# EAGLE schematic PSU (EAGLE 7.6.0)
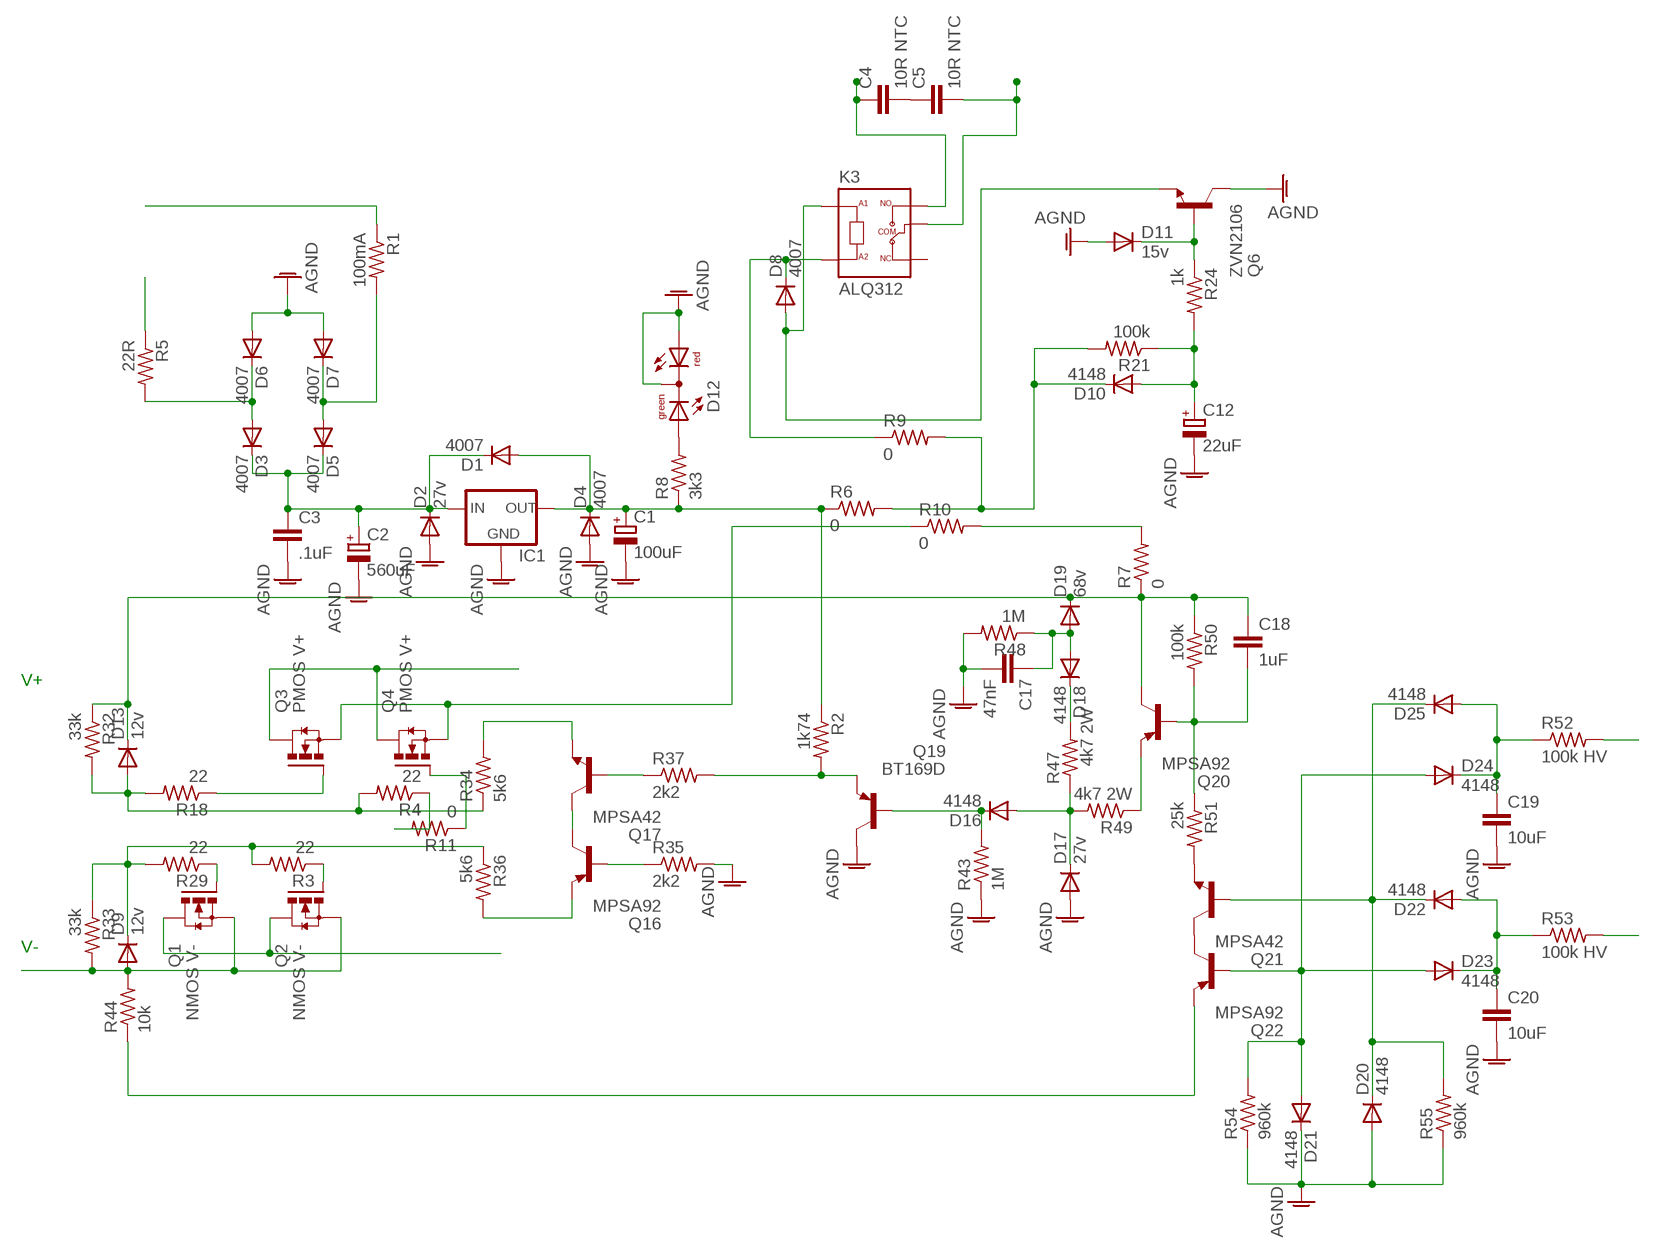
[diagram p0: schematic, sheet 1]

## Parts
C1  100uF  CPOL-EUE3.5-10  [E3,5-10]
C2  560uF  CPOL-EUE5-13  [E5-13]
C3  .1uF  C-EU075-032X103  [C075-032X103]
C4  10R NTC  C-EU075-063X106  [C075-063X106]
C5  10R NTC  C-EU075-063X106  [C075-063X106]
C12  22uF  CPOL-EUE2.5-7  [E2,5-7]
C17  47nF  C-EU050-035X075  [C050-035X075]
C18  1uF  C-EU050-035X075  [C050-035X075]
C19  10uF  C-EU050-075X075  [C050-075X075]
C20  10uF  C-EU050-075X075  [C050-075X075]
D1  4007  1N4004  [DO41-10]
D2  27v  1N4004  [DO41-10]
D3  4007  1N4004  [DO41-10]
D4  4007  1N4004  [DO41-10]
D5  4007  1N4004  [DO41-10]
D6  4007  1N4004  [DO41-10]
D7  4007  1N4004  [DO41-10]
D8  4007  1N4004  [DO41-10]
D9  12v  1N4004  [DO41-10]
D10  4148  1N4148DO35-10  [DO35-10]
D11  15v  1N4148DO35-7  [DO35-7]
D12  DUOLED5MM  [DUOLED5MM]
D13  12v  1N4004  [DO41-10]
D16  4148  1N4004  [DO41-10]
D17  27v  1N4004  [DO41-10]
D18  4148  1N4004  [DO41-10]
D19  68v  1N4004  [DO41-10]
D20  4148  1N4148DO35-7  [DO35-7]
D21  4148  1N4148DO35-7  [DO35-7]
D22  4148  1N4148DO35-7  [DO35-7]
D23  4148  1N4148DO35-7  [DO35-7]
D24  4148  1N4148DO35-7  [DO35-7]
D25  4148  1N4148DO35-7  [DO35-7]
IC1  78XXS  [78XXS]
K3  ALQ312  ALQ112  [RELAY_ALQ112]
Q1  NMOS V-  IRFP240  [TO247BV]
Q2  NMOS V-  IRFP240  [TO247BV]
Q3  PMOS V+  IRFP240  [TO247BV]
Q4  PMOS V+  IRFP240  [TO247BV]
Q6  ZVN2106  BC550B  [TO92-EBC]
Q16  MPSA92  BC560  [TO92-EBC]
Q17  MPSA42  BC550B  [TO92-EBC]
Q19  BT169D  BC560  [TO92-EBC]
Q20  MPSA92  BC560  [TO92-EBC]
Q21  MPSA42  BC550B  [TO92-EBC]
Q22  MPSA92  BC560  [TO92-EBC]
R1  100mA  R-US_0207/5V  [0207/5V]
R2  1k74  R-US_0309/10  [0309/10]
R3  22  R-US_0309/12  [0309/12]
R4  22  R-US_0309/12  [0309/12]
R5  22R  R-US_0309/12  [0309/12]
R6  0  R-US_0309/12  [0309/12]
R7  0  R-US_0309/12  [0309/12]
R8  3k3  R-US_0309/10  [0309/10]
R9  0  R-US_0309/10  [0309/10]
R10  0  R-US_0309/12  [0309/12]
R11  0  R-US_0309/12  [0309/12]
R18  22  R-US_0207/15  [0207/15]
R21  100k  R-US_0309/10  [0309/10]
R24  1k  R-US_0309/10  [0309/10]
R29  22  R-US_0207/15  [0207/15]
R32  33k  R-US_0411/15  [0411/15]
R33  33k  R-US_0411/15  [0411/15]
R34  5k6  R-US_0411/15  [0411/15]
R35  2k2  R-US_0309/10  [0309/10]
R36  5k6  R-US_0411/15  [0411/15]
R37  2k2  R-US_0309/10  [0309/10]
R43  1M  R-US_0309/10  [0309/10]
R44  10k  R-US_0411/15  [0411/15]
R47  4k7 2W  R-US_0309/10  [0309/10]
R48  1M  R-US_0411/15  [0411/15]
R49  4k7 2W  R-US_0309/10  [0309/10]
R50  100k  R-US_0309/10  [0309/10]
R51  25k  R-US_0309/10  [0309/10]
R52  100k HV  R-US_0309/12  [0309/12]
R53  100k HV  R-US_0309/12  [0309/12]
R54  960k  R-US_0309/10  [0309/10]
R55  960k  R-US_0309/10  [0309/10]

## Nets
AGND: C1.- C2.- C3.2 C12.- C17.2 C19.2 C20.2 D2.A D4.A D6.A D7.A D11.A D12.AR D12.K(C) D17.A D20.A D21.C IC1.GND Q6.C Q19.C R35.2 R43.1 R48.2 R54.1 R55.1
N$1: C2.+ C3.1 D1.C D2.C D3.C D5.C IC1.IN
N$2: D3.A D6.C R5.2
N$4: C1.+ D1.A D4.C IC1.OUT R2.1 R6.1 R8.1
N$5: D5.A D7.C R1.2
N$10: C4.1 K3.5(NO)
N$11: Q3.G R18.1
N$12: Q1.G R29.1
N$13: R4.1 R11.2
N$14: Q2.G R3.1
N$15: D8.A K3.1(A1) Q6.E
N$16: D10.C R6.2 R9.2 R21.2
N$17: R1.1
N$18: R5.1
N$19: C5.2 K3.3(COM)
N$20: D8.C K3.2(A2) R9.1
N$22: R7.2 R10.2
N$24: D12.AG R8.2
N$30: D9.C R3.2 R29.2 R33.1 R36.1
N$36: Q4.G R11.1
N$37: Q3.S Q4.S R10.1
N$39: C4.2 C5.1
N$40: C12.+ D10.A R21.1 R24.2
N$43: D11.C Q6.B R24.1
N$54: Q3.D Q4.D
N$55: D9.A Q1.S Q2.S R33.2 R44.2
N$57: Q1.D Q2.D
N$65: D13.A R4.2 R18.2 R32.2 R34.1
N$70: Q17.E R34.2
N$71: Q16.E R36.2
N$72: Q16.C Q17.C
N$73: Q16.B R35.1
N$74: Q17.B R37.1
N$75: Q19.E R2.2 R37.2
N$79: D16.C Q19.B R43.2
N$88: C18.1 D13.C D19.C Q20.C R7.1 R32.1 R50.1
N$89: Q22.E R44.1
N$90: Q20.E R49.1
N$91: D16.A D17.C R47.1 R49.2
N$92: D18.C R47.2
N$93: C17.1 D18.A D19.A R48.1
N$94: C18.2 Q20.B R50.2 R51.1
N$95: Q21.E R51.2
N$96: Q21.C Q22.C
N$98: D21.A D23.A D24.A Q22.B R54.2
N$99: D20.C D22.C D25.C Q21.B R55.2
N$100: C20.1 D22.A D23.C R53.1
N$101: C19.1 D24.C D25.A R52.1
N$103: R52.2
N$106: R53.2
Unconnected: K3.4(NC)

## Notes on the sheet
- V+
- V-

## Library data of the parts
C1 C2 C12 = resistor:CPOL-EU: POLARIZED CAPACITOR, European symbol
C3-C5 C17-C20 = resistor:C-EU: CAPACITOR, European symbol
D1-D9 D13 D16-D19 = diode:1N4004: DIODE general purpose rectifier, 1 A
D10 D11 D20-D25 = diode:1N4148: DIODE high speed (Philips)
D12 = led:DUOLED5MM: DUO LED 2 colors, 5 mm, round
IC1 = v-reg:78XXS: VOLTAGE REGULATOR
K3 = ALQ112:ALQ112: ALQ Series SPDT 10 A 12 V PC Pin Through Hole Non Latching Miniature Power Relay; AVAILABILITY: Unavailable; DESCRIPTION: General Purpose Relay SPDT _1 Form C_ 12VDC Coil Through Hole; MF: Panasonic Electric; MP: ALQ112; PACKAGE: FBGA-484 Panasonic; PRICE: None
Q1-Q4 = transistor-power:IRFP240: HEXFET Power MosFet Source: http://www.irf.com/
Q6 Q17 Q21 = transistor-npn:BC550*: NPN Transistor
Q16 Q19 Q20 Q22 = transistor-pnp:BC560*: PNP Transistror
R1-R11 R18 R21 R24 R29 R32-R37 R43 R44 R47-R55 = resistor:R-US_: RESISTOR, American symbol